# Altium schematic sheet E3.SchDoc
size 420 x 297 mm; Address1: Address1; Address2: Address2; Address3: Address3; Address4: Address4; DocumentNumber: АБВГ.123456.001 Э3; SheetNumber: 5; SheetTotal: 5; DocumentType: Схема электрическая принципиальная; FirstReferrence: АБВГ.123456.001; Разработал: Лисица А.Е.; Проверил: Курносенко А.Е.; Тип чертежа: Схема электрическая структурная; Название: Устройство управления; Учреждение: МГТУ им. Н. Э. Баумана; Группа: ИУ4-81Б; Децимальный номер: ИУ4.11.03.03.26.08.81.12.001 Э3; Лист: 1; Кафедра: Кафедра ИУ4; Децимальный номер СП: ИУ4.11.03.03.26.08.81.12.001 Э3; Продолжение названия: шаговым двигателем; Листов: 1
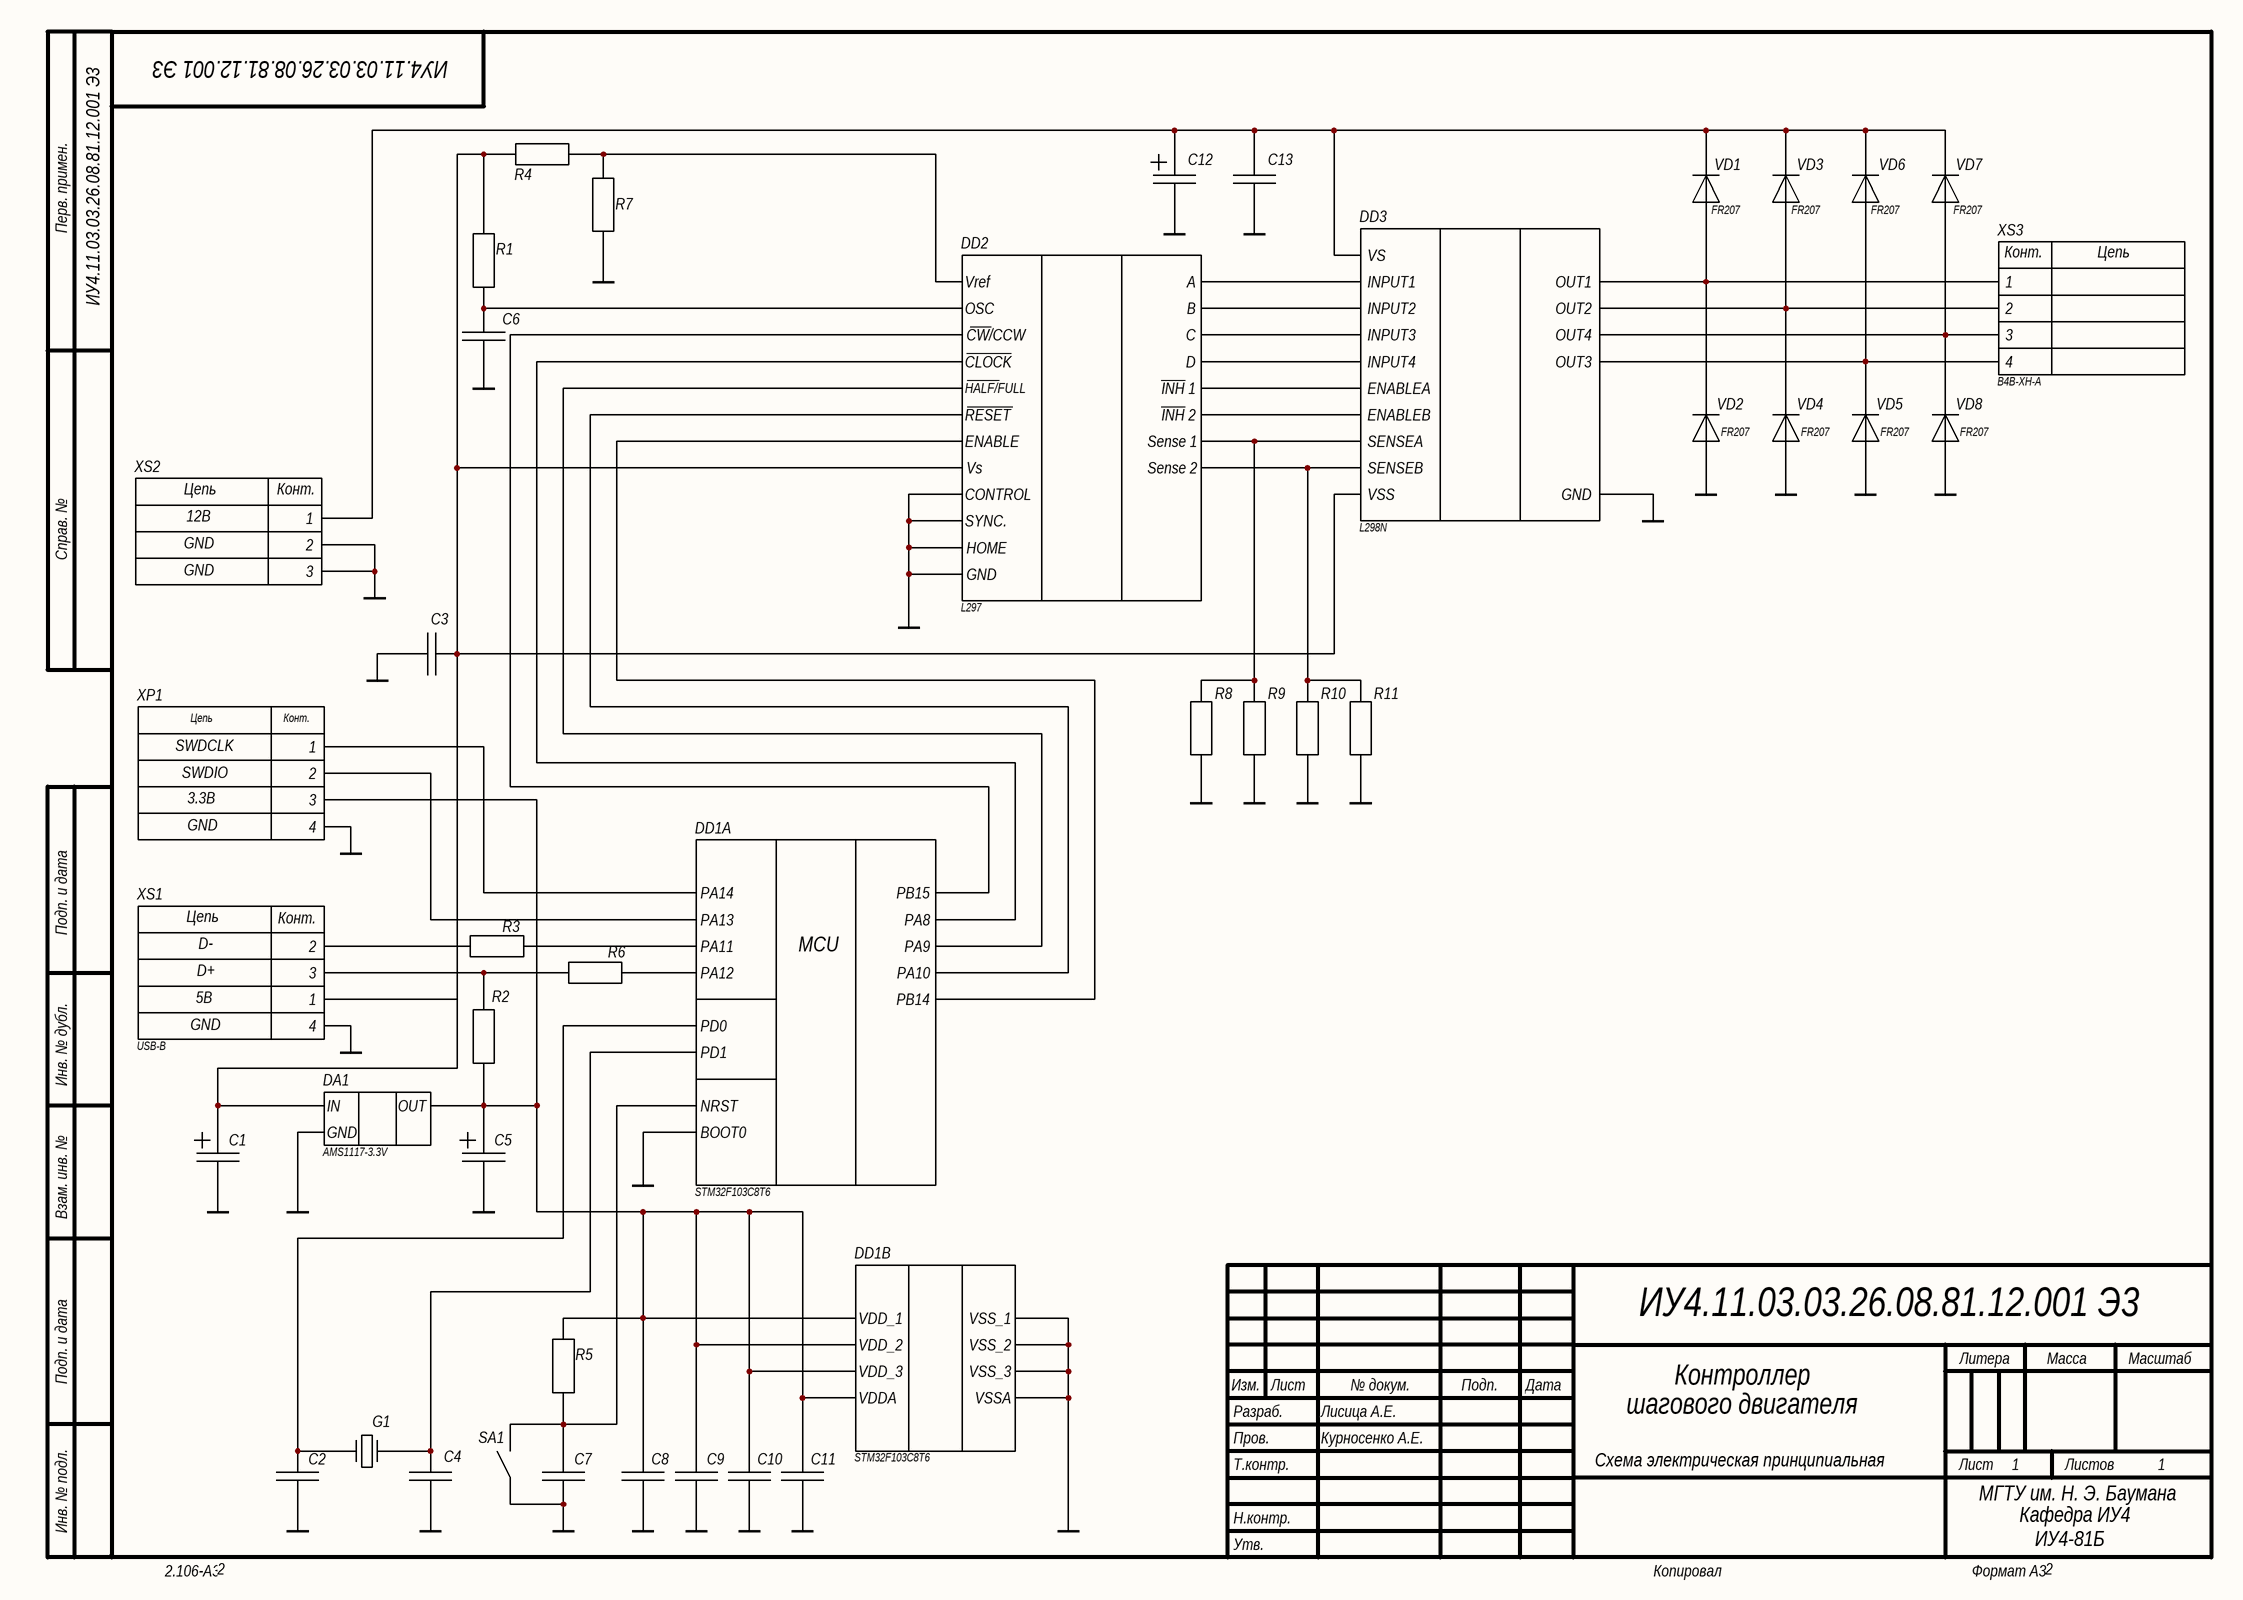
[diagram p0: E3.SchDoc]

## Parts
C1  47uF  [ECAPT_6032(C)]  (value not drawn)
C2  CAP_SMD_1206  [CAP_0603]  (value not drawn)
C3  CAP_SMD_1206  [CAP_0603]  (value not drawn)
C4  CAP_SMD_1206  [CAP_0603]  (value not drawn)
C5  22uF  [ECAPT_6032(C)]  (value not drawn)
C6  CAP_SMD_1206  [CAP_0603]  (value not drawn)
C7  CAP_SMD_1206  [CAP_0603]  (value not drawn)
C8  CAP_SMD_1206  [CAP_0603]  (value not drawn)
C9  CAP_SMD_1206  [CAP_0603]  (value not drawn)
C10  CAP_SMD_1206  [CAP_0603]  (value not drawn)
C11  CAP_SMD_1206  [CAP_0603]  (value not drawn)
C12  ECAP_10×10.2_SMD  [ECAP_SMD_10x10.2]  (value not drawn)
C13  CAP_SMD_1206  [CAP_1206(SMD)]  (value not drawn)
DA1  AMS1117-3.3V  [SOT-223]
DD1  STM32F103C8T6  [LQFP48_STM-L]  (parts A,B of 2)
DD2  L297  [SO-20_STM]
DD3  L298N  [Multiwatt15_V_STM]
G1  OSC8MHz  [OSC8MHz]  (value not drawn)
R1  22k  [RES_1206(SMD)]  (value not drawn)
R2  1.5к  [RES_1206(SMD)]  (value not drawn)
R3  22 Omh  [RES_1206(SMD)]  (value not drawn)
R4  10k  [RES_1206(SMD)]  (value not drawn)
R5  10k  [RES_1206(SMD)]  (value not drawn)
R6  22 Omh  [RES_1206(SMD)]  (value not drawn)
R7  2.4k  [RES_1206(SMD)]  (value not drawn)
R8  1 Ом  [RES_2512(SMD)]  (value not drawn)
R9  1 Ом  [RES_2512(SMD)]  (value not drawn)
R10  1 Ом  [RES_2512(SMD)]  (value not drawn)
R11  1 Ом  [RES_2512(SMD)]  (value not drawn)
SA1  button  (value not drawn)
VD1  FR207  [THT_DIODE]
VD2  FR207  [THT_DIODE]
VD3  FR207  [THT_DIODE]
VD4  FR207  [THT_DIODE]
VD5  FR207  [THT_DIODE]
VD6  FR207  [THT_DIODE]
VD7  FR207  [THT_DIODE]
VD8  FR207  [THT_DIODE]
XP1  PLS-4  [PLS2-4]  (value not drawn)
XS1  USB-B  [USB_B_FEMALE]
XS2  POWER  [2.5 x 6.5 mm32]  (value not drawn)
XS3  B4B-XH-A  [B4B-XH-A]

## Nets
GND: C1.2 C2.2 C3.1 C4.2 C5.2 C6.2 C7.1 C8.2 C9.2 C10.2 C11.2 C12.1 C13.2 DA1.1(GND) DD1.8(VSSA) DD1.23(VSS_1) DD1.35(VSS_2) DD1.44(BOOT0) DD1.47(VSS_3) DD2.1(SYNC.) DD2.2(GND) DD2.3(HOME) DD2.11(CONTROL) DD3.8(GND) R7.2 R8.2 R9.2 R10.2 R11.2 SA1.1 VD2.1 VD4.1 VD5.1 VD8.1 XP1.4 XS1.4 XS2.2 XS2.3
NetC1_1: C1.1 C3.2 DA1.3(IN) DD2.12(Vs) DD3.9(VSS) R1.2 R4.1 XS1.1
NetC2_1: C2.1 DD1.5(PD0) G1.2(output)
NetC4_1: C4.1 DD1.6(PD1) G1.1(input)
NetC5_1: C5.1 C8.1 C9.1 C10.1 C11.1 DA1.2(OUT) DD1.9(VDDA) DD1.24(VDD_1) DD1.36(VDD_2) DD1.48(VDD_3) R2.2 R5.2 XP1.3
NetC6_1: C6.1 DD2.16(OSC) R1.1
NetC7_2: C7.2 DD1.7(NRST) R5.1 SA1.2
NetC12_2: C12.2 C13.1 DD3.4(VS) VD1.2 VD3.2 VD6.2 VD7.2 XS2.1
NetDD1_27: DD1.27(PB14) DD2.10(ENABLE)
NetDD1_28: DD1.28(PB15) DD2.17(CW/CCW)
NetDD1_29: DD1.29(PA8) DD2.18(CLOCK)
NetDD1_30: DD1.30(PA9) DD2.19(HALF/FULL)
NetDD1_31: DD1.31(PA10) DD2.20(RESET)
NetDD1_32: DD1.32(PA11) R3.1
NetDD1_33: DD1.33(PA12) R6.1
NetDD1_34: DD1.34(PA13) XP1.2
NetDD1_37: DD1.37(PA14) XP1.1
NetDD2_4: DD2.4(A) DD3.5(INPUT1)
NetDD2_5: DD2.5(INH_1) DD3.6(ENABLEA)
NetDD2_6: DD2.6(B) DD3.7(INPUT2)
NetDD2_7: DD2.7(C) DD3.10(INPUT3)
NetDD2_8: DD2.8(INH_2) DD3.11(ENABLEB)
NetDD2_9: DD2.9(D) DD3.12(INPUT4)
NetDD2_13: DD2.13(Sense_2) DD3.15(SENSEB) R10.1 R11.1
NetDD2_14: DD2.14(Sense_1) DD3.1(SENSEA) R8.1 R9.1
NetDD2_15: DD2.15(Vref) R4.2 R7.1
NetDD3_2: DD3.2(OUT1) VD1.1 VD2.2 XS3.1
NetDD3_3: DD3.3(OUT2) VD3.1 VD4.2 XS3.2
NetDD3_13: DD3.13(OUT3) VD5.2 VD6.1 XS3.4
NetDD3_14: DD3.14(OUT4) VD7.1 VD8.2 XS3.3
NetR2_1: R2.1 R6.2 XS1.3
NetR3_2: R3.2 XS1.2

## Notes on the sheet
- SWDCLK
- SWDIO
- 3.3В
- GND
- Контроллер
- Схема электрическая принципиальная
- шагового двигателя
- 2
- Перв. примен.
- Справ. №
- Подп. и дата
- Инв. № дубл.
- Взам. инв. №
- Разраб.
- Изм.
- Лист
- № докум.
- Подп.
- Дата
- Литера
- Масса
- Масштаб
- Пров.
- Т.контр.
- Листов
- Инв. № подл.
- Утв.
- Н.контр.
- 2.106-A3
- Копировал
- Формат А3
- (in symbol B4B-XH-A) Конт.; Цепь
- (in symbol POWER) Цепь; Конт.; 12В; GND
- (in symbol STM32F103C8T6_Stepper, part A) MCU
- (in symbol SWD) Цепь; Конт.
- (in symbol USB_B) Цепь; Конт.; D-; D+; 5В; GND

## Library data of the parts
C1 C5 = ECAPT_6032: Tantalum_SMD; ComponentLink1Description: ChipDip
  C1: ComponentLink1URL: https://www.chipdip.ru/product/293d476x0016c2te3-chip-tant-16v-47mkf-20-c-vishay-8002699624
  C5: ComponentLink1URL: https://www.chipdip.ru/product/293d226x9010c2te3-chip-tant-10v-22mkf-10-c-vishay-8389874982
DA1 = AMS1117-3.3V: 800mA LOW DROPOUT VOLTAGE REGULATOR SOT-223 PACKAGE
DD1 = STM32F103C8T6_Stepper: ARM microcontroller; Flash: 64kB; 72MHz; SRAM: 20kB; LQFP48
DD2 = L297_SO20
DD3 = L298N: DUAL FULL-BRIDGE DRIVER
R1 R2 R4 R5 R7 = RES_SMD_1206: ComponentLink1Description: Chip Dip
  R1 R5: ComponentLink1URL: https://www.chipdip.ru/product/0.25vt-1206-10-kom-1-chip-rezistor-smd-9000079659
  R2: ComponentLink1URL: https://www.chipdip.ru/product/0.25vt-1206-22-om-1-chip-rezistor-smd-9000079875
  R4 R7: ComponentLink1URL: https://www.chipdip.ru/product/0.25vt-1206-430-om-1-chip-rezistor-smd-9000079906
R3 R6 = RES_SMD_1206: 20 Omh; ComponentLink1Description: Chip Dip; ComponentLink1URL: https://www.chipdip.ru/product/0.25vt-1206-22-om-1-chip-rezistor-smd-9000079875
R8-R11 = RES_2512: ComponentLink1Description: Chip Dip
  R8 R10 R11: ComponentLink1URL: https://www.chipdip.ru/product/1vt-2512-1-om-chip-rezistor-smd-9000190001
  R9: ComponentLink1URL: *https://www.chipdip.ru/product/1vt-2512-1-om-chip-rezistor-smd-9000190001
XP1 = SWD
XS1 = USB_B: SOCKET 4PIN USB B 2.0
XS3 = B4B-XH-A: SOCKET 4PIN, вилка прямая на плату
C12 = ECAP_10×10.2_SMD: ComponentLink1Description: Shop; ComponentLink1URL: https://www.chipdip.ru/product/ecap-smd-470mkf-25v-105-s-10-10.2mm-eeefk1e471p-panasonic-9000100744; ComponentLink2Description: Alternate; ComponentLink2URL: https://www.chipdip.ru/product/ecap-smd-470mkf-25v-105-c-20-10x10.5mm-jb-capacitors-9000565751